# Altium schematic sheet 1_P3.schdoc
size 309 x 223 mm
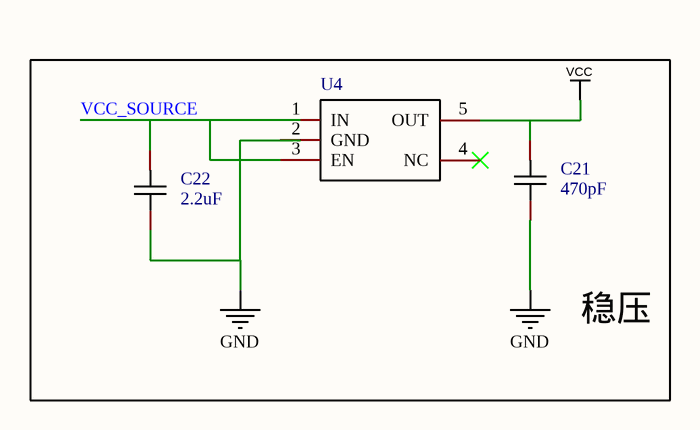
[diagram p0: 1_P3.schdoc]

## Parts
C21  value 470pF  [C0201]  (hidden comment: GRM0335C1H470JA01D)
C22  value 2.2uF  [C0201]  (hidden comment: GRM0335C1H470JA01D)
U4  MIC5203-3.3YM5-TR  [SOT-23-5_L3.0-W1.7-P0.95-LS2.8-BL]  (value not drawn)

## Blocks framed on the sheet
稳压: C21 C22 U4

## Nets
GND: C21.1 C22.1 U4.2(GND)
VCC: C21.2 U4.5(OUT)
VCC_SOURCE: C22.2 U4.1(IN) U4.3(EN)

Not connected (* = marked no-connect by the designer): U4 4(NC)*

## Library data of the parts
C21 C22 = GRM0335C1H470JA01D: 温度系数:C0G;精度:±5%;额定电压:50V;容值:47pF;; Manufacturer: muRata(村田); Add into BOM: yes; Temperature Coefficient: C0G; Tolerance: ±5%; Voltage Rated: 50V; Symbol: GRM0335C1H470JA01D; Device: GRM0335C1H470JA01D; LCSC Part Name: 47pF(470) ±5% 50V; Supplier Part: C85908; Manufacturer Part: GRM0335C1H470JA01D; Supplier Footprint: 0201; Datasheet: https://atta.szlcsc.com/upload/public/pdf/source/20180326/C85908_9E2E1A0386E64FE3BC8CC7D032B4DB3D.pdf; Supplier: LCSC; Convert to PCB: yes
U4 = MIC5203-3.3YM5-TR: 输出类型:固定;输出极性:正;输出通道数:1;最大输入电压:16V;输出电压:3.3V;压差:600mV@(80mA);输出电流:80mA;电源纹波抑制比(PRSS):-;; Manufacturer: MICROCHIP(美国微芯); Add into BOM: yes; Output Type: 固定; Output Polarity: 正; Number of Outputs: 1; Maximum Input Voltage: 16V; Output Voltage: 3.3V; Symbol: MIC5203-3.3YM5-TR; Device: MIC5203-3.3YM5-TR; LCSC Part Name: Vin=16V Vout=3.3V 80mA; Supplier Part: C127931; Manufacturer Part: MIC5203-3.3YM5-TR; Supplier Footprint: SOT-23-5; JLCPCB Part Class: Extended Part; Datasheet: https://atta.szlcsc.com/upload/public/pdf/source/20170919/C127931_1505787119787976789.pdf; Supplier: LCSC; Convert to PCB: yes; Dropout Voltage: 600mV@(80mA); Output Current: 80mA; Power Supply Rejection Ratio (PRSS): -